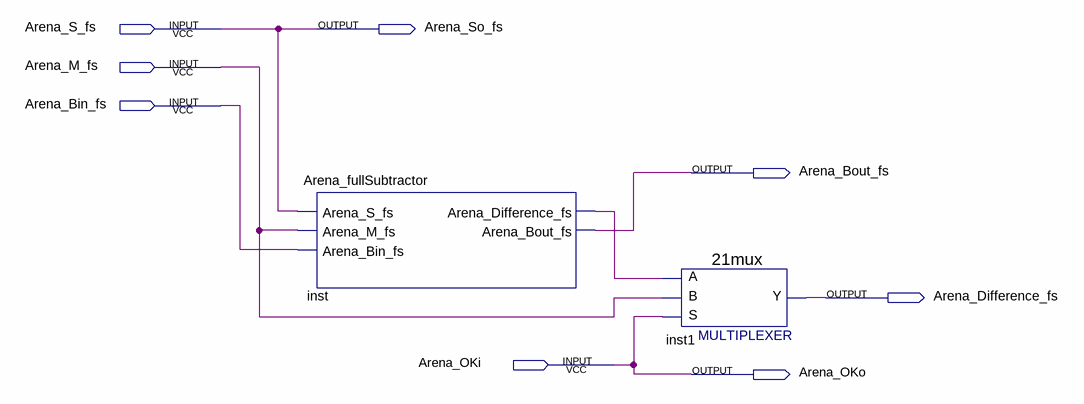
[diagram p0: schematic sheet]
// Quartus schematic Arena_1bitDivider.bdf as structural Verilog: 2 symbols, 8 pins
module Arena_1bitDivider (
  input  Arena_S_fs,
  input  Arena_M_fs,
  input  Arena_Bin_fs,
  input  Arena_OKi,
  output Arena_So_fs,
  output Arena_Bout_fs,
  output Arena_Difference_fs,
  output Arena_OKo
);

  wire inst_arena_difference_fs;

  Arena_fullSubtractor inst (
    .Arena_S_fs(Arena_S_fs), .Arena_M_fs(Arena_M_fs), .Arena_Bin_fs(Arena_Bin_fs),
    .Arena_Difference_fs(inst_arena_difference_fs), .Arena_Bout_fs(Arena_Bout_fs));
  \21mux  inst1 (.S(Arena_OKi), .B(Arena_M_fs), .A(inst_arena_difference_fs), .Y(Arena_Difference_fs));

  assign Arena_OKo = Arena_OKi;
  assign Arena_So_fs = Arena_S_fs;
endmodule
